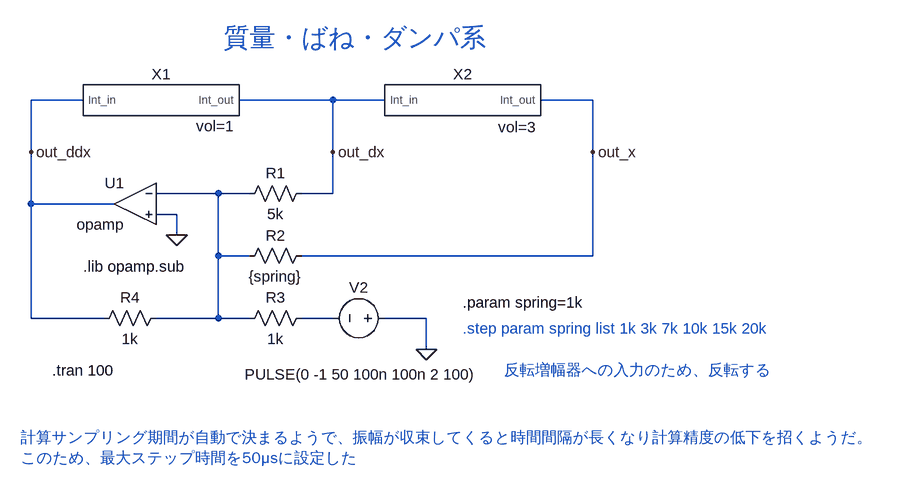
[diagram p0: schematic mass-spring_lv2_real.asc]
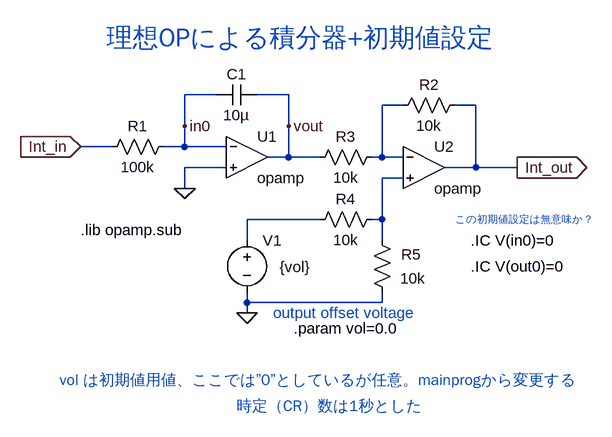
[diagram p1: sub-circuit int_lv2.asc]
mass-spring_lv2_real.asc, the LTspice schematic file:
Version 4.1
SHEET 1 916 680
WIRE -512 -32 -592 -32
WIRE -128 -32 -272 -32
WIRE -48 -32 -128 -32
WIRE 272 -32 192 -32
WIRE -592 48 -592 -32
WIRE -128 48 -128 -32
WIRE 272 48 272 -32
WIRE -304 112 -400 112
WIRE -256 112 -304 112
WIRE -128 112 -128 48
WIRE -128 112 -176 112
WIRE -592 128 -592 48
WIRE -464 128 -592 128
WIRE -368 144 -400 144
WIRE -368 176 -368 144
WIRE -304 208 -304 112
WIRE -256 208 -304 208
WIRE 272 208 272 48
WIRE 272 208 -176 208
WIRE -592 304 -592 128
WIRE -480 304 -592 304
WIRE -304 304 -304 208
WIRE -304 304 -400 304
WIRE -256 304 -304 304
WIRE -128 304 -176 304
WIRE 16 304 -48 304
WIRE 16 352 16 304
FLAG -368 176 0
FLAG -592 48 out_ddx
FLAG -128 48 out_dx
FLAG 272 48 out_x
FLAG 16 352 0
SYMBOL res -160 96 R90
WINDOW 0 0 56 VBottom 2
WINDOW 3 32 56 VTop 2
SYMATTR InstName R1
SYMATTR Value 5k
SYMBOL res -160 192 R90
WINDOW 0 0 56 VBottom 2
WINDOW 3 32 56 VTop 2
SYMATTR InstName R2
SYMATTR Value {spring}
SYMBOL res -160 288 R90
WINDOW 0 0 56 VBottom 2
WINDOW 3 32 56 VTop 2
SYMATTR InstName R3
SYMATTR Value 1k
SYMBOL res -384 288 R90
WINDOW 0 0 56 VBottom 2
WINDOW 3 32 56 VTop 2
SYMATTR InstName R4
SYMATTR Value 1k
SYMBOL OpAmps\\opamp -432 64 M0
SYMATTR InstName U1
SYMBOL INT_lv2 -400 -32 R0
WINDOW 39 91 56 Bottom 2
SYMATTR SpiceLine vol=1
SYMATTR InstName X1
SYMBOL INT_lv2 64 -32 R0
WINDOW 39 92 57 Bottom 2
SYMATTR SpiceLine vol=3
SYMATTR InstName X2
SYMBOL voltage -32 304 M270
WINDOW 0 32 56 VTop 2
WINDOW 3 -71 52 VBottom 2
WINDOW 123 0 0 Left 0
WINDOW 39 0 0 Left 0
SYMATTR InstName V2
SYMATTR Value PULSE(0 -1 50 100n 100n 2 100)
TEXT -560 384 Left 2 !.tran 100
TEXT -512 224 Left 2 !.lib opamp.sub
TEXT 136 384 Left 2 ;反転増幅器への入力のため、反転する
TEXT 72 280 Left 2 !.param spring=1k
TEXT 72 320 Left 2 ;.step param spring list 1k 3k 7k 10k 15k 20k
TEXT -608 488 Left 2 ;計算サンプリング期間が自動で決まるようで、振幅が収束してくると時間間隔が長くなり計算精度の低下を招くようだ。
TEXT -608 520 Left 2 ;このため、最大ステップ時間を50μsに設定した
TEXT -296 -128 Left 4 ;質量・ばね・ダンパ系

int_lv2.asc, the sub-circuit schematic file:
Version 4.1
SHEET 1 880 680
WIRE 16 -128 -32 -128
WIRE 128 -128 80 -128
WIRE 304 -112 272 -112
WIRE 416 -112 384 -112
WIRE -32 -80 -32 -128
WIRE 128 -80 128 -128
WIRE -144 -48 -192 -48
WIRE -32 -48 -32 -80
WIRE -32 -48 -64 -48
WIRE 32 -48 -32 -48
WIRE 128 -32 128 -80
WIRE 128 -32 96 -32
WIRE 176 -32 128 -32
WIRE 272 -32 272 -112
WIRE 272 -32 256 -32
WIRE 304 -32 272 -32
WIRE 32 -16 -32 -16
WIRE 416 -16 416 -112
WIRE 416 -16 368 -16
WIRE 480 -16 416 -16
WIRE 304 0 272 0
WIRE -32 16 -32 -16
WIRE 176 64 64 64
WIRE 272 64 272 0
WIRE 272 64 256 64
WIRE 64 96 64 64
WIRE 272 96 272 64
WIRE 64 192 64 176
WIRE 272 192 272 176
WIRE 272 192 64 192
WIRE 64 208 64 192
FLAG -192 -48 Int_in
IOPIN -192 -48 In
FLAG 128 -80 vout
FLAG 480 -16 Int_out
IOPIN 480 -16 Out
FLAG -32 -80 in0
FLAG -32 16 0
FLAG 64 208 0
SYMBOL cap 16 -112 R270
WINDOW 0 32 32 VTop 2
WINDOW 3 0 32 VBottom 2
SYMATTR InstName C1
SYMATTR Value 10µ
SYMBOL res -48 -64 R90
WINDOW 0 0 56 VBottom 2
WINDOW 3 32 56 VTop 2
SYMATTR InstName R1
SYMATTR Value 100k
SYMBOL OpAmps\\opamp 64 -96 R0
SYMATTR InstName U1
SYMATTR SpiceLine Aol=10meg
SYMATTR SpiceLine2 GBW=1g
SYMBOL OpAmps\\opamp 336 -80 R0
SYMATTR InstName U2
SYMATTR SpiceLine Aol=10meg
SYMATTR SpiceLine2 GBW=1g
SYMBOL res 400 -128 R90
WINDOW 0 0 56 VBottom 2
WINDOW 3 32 56 VTop 2
SYMATTR InstName R2
SYMATTR Value 10k
SYMBOL res 272 -48 R90
WINDOW 0 0 56 VBottom 2
WINDOW 3 32 56 VTop 2
SYMATTR InstName R3
SYMATTR Value 10k
SYMBOL res 272 48 R90
WINDOW 0 0 56 VBottom 2
WINDOW 3 32 56 VTop 2
SYMATTR InstName R4
SYMATTR Value 10k
SYMBOL res 288 192 R180
WINDOW 0 -44 74 Left 2
WINDOW 3 -51 37 Left 2
SYMATTR InstName R5
SYMATTR Value 10k
SYMBOL voltage 64 80 R0
WINDOW 123 0 0 Left 0
WINDOW 39 0 0 Left 0
WINDOW 3 50 57 Left 2
SYMATTR Value {vol}
SYMATTR InstName V1
TEXT -192 80 Left 2 !.lib opamp.sub
TEXT 136 232 Left 2 !.param vol=0.0
TEXT -224 312 Left 2 ;vol は初期値用値、ここでは”0”としているが任意。mainprogから変更する
TEXT 48 352 Left 2 ;時定（CR）数は1秒とした
TEXT 104 208 Left 2 ;output offset voltage
TEXT 408 96 Left 2 !.IC V(in0)=0
TEXT 408 136 Left 2 !.IC V(out0)=0
TEXT 384 64 Left 1 ;この初期値設定は無意味か？
TEXT -152 -216 Left 4 ;理想OPによる積分器+初期値設定

The netlist it stands for:
* mass-spring_lv2_real.asc
R1 out_dx N001 5k
R2 out_x N001 {spring}
R3 N002 N001 1k
R4 N001 out_ddx 1k
X§U1 N001 0 out_ddx opamp Aol=100K GBW=10Meg  ; pins invin noninvin out
X§X1 out_ddx out_dx int_lv2 params: vol=1
X§X2 out_dx out_x int_lv2 params: vol=3
V2 0 N002 PULSE(0 -1 50 100n 100n 2 100)

* block symbol definitions
.subckt int_lv2 Int_in Int_out
C1 in0 vout 10µ
R1 in0 Int_in 100k
X§U1 in0 0 vout opamp Aol=10meg GBW=1g  ; pins invin noninvin out
X§U2 N001 N002 Int_out opamp Aol=10meg GBW=1g  ; pins invin noninvin out
R2 Int_out N001 10k
R3 N001 vout 10k
R4 N002 N003 10k
R5 0 N002 10k
V1 N003 0 {vol}
.lib opamp.sub
.param vol=0.0
* vol は初期値用値、ここでは”0”としているが任意。mainprogから変更する
* 時定（CR）数は1秒とした
* output offset voltage
.IC V(in0)=0
.IC V(out0)=0
* この初期値設定は無意味か？
* 理想OPによる積分器+初期値設定
.ends int_lv2

.tran 100
.lib opamp.sub
* 反転増幅器への入力のため、反転する
.param spring=1k
* .step param spring list 1k 3k 7k 10k 15k 20k
* 計算サンプリング期間が自動で決まるようで、振幅が収束してくると時間間隔が長くなり計算精度の低下を招くようだ。
* このため、最大ステップ時間を50μsに設定した
* 質量・ばね・ダンパ系
.backanno
.end